# Altium project coursework_larionov.PrjPcb (part 2 of 2)

## Sheet 006_HDMI.SchDoc: Плата материнская Jetson Nano
size 840 x 594 mm; ApprovedBy: Капустин; CheckedBy: Капустин; DrawnBy: Ларионов; DocumentNumber: СПБПУ.3331506.016Ý3; SheetNumber: 6; SheetTotal: 9; DocumentCode: Ý3; ImagePath: СПБПУ.3331506.016
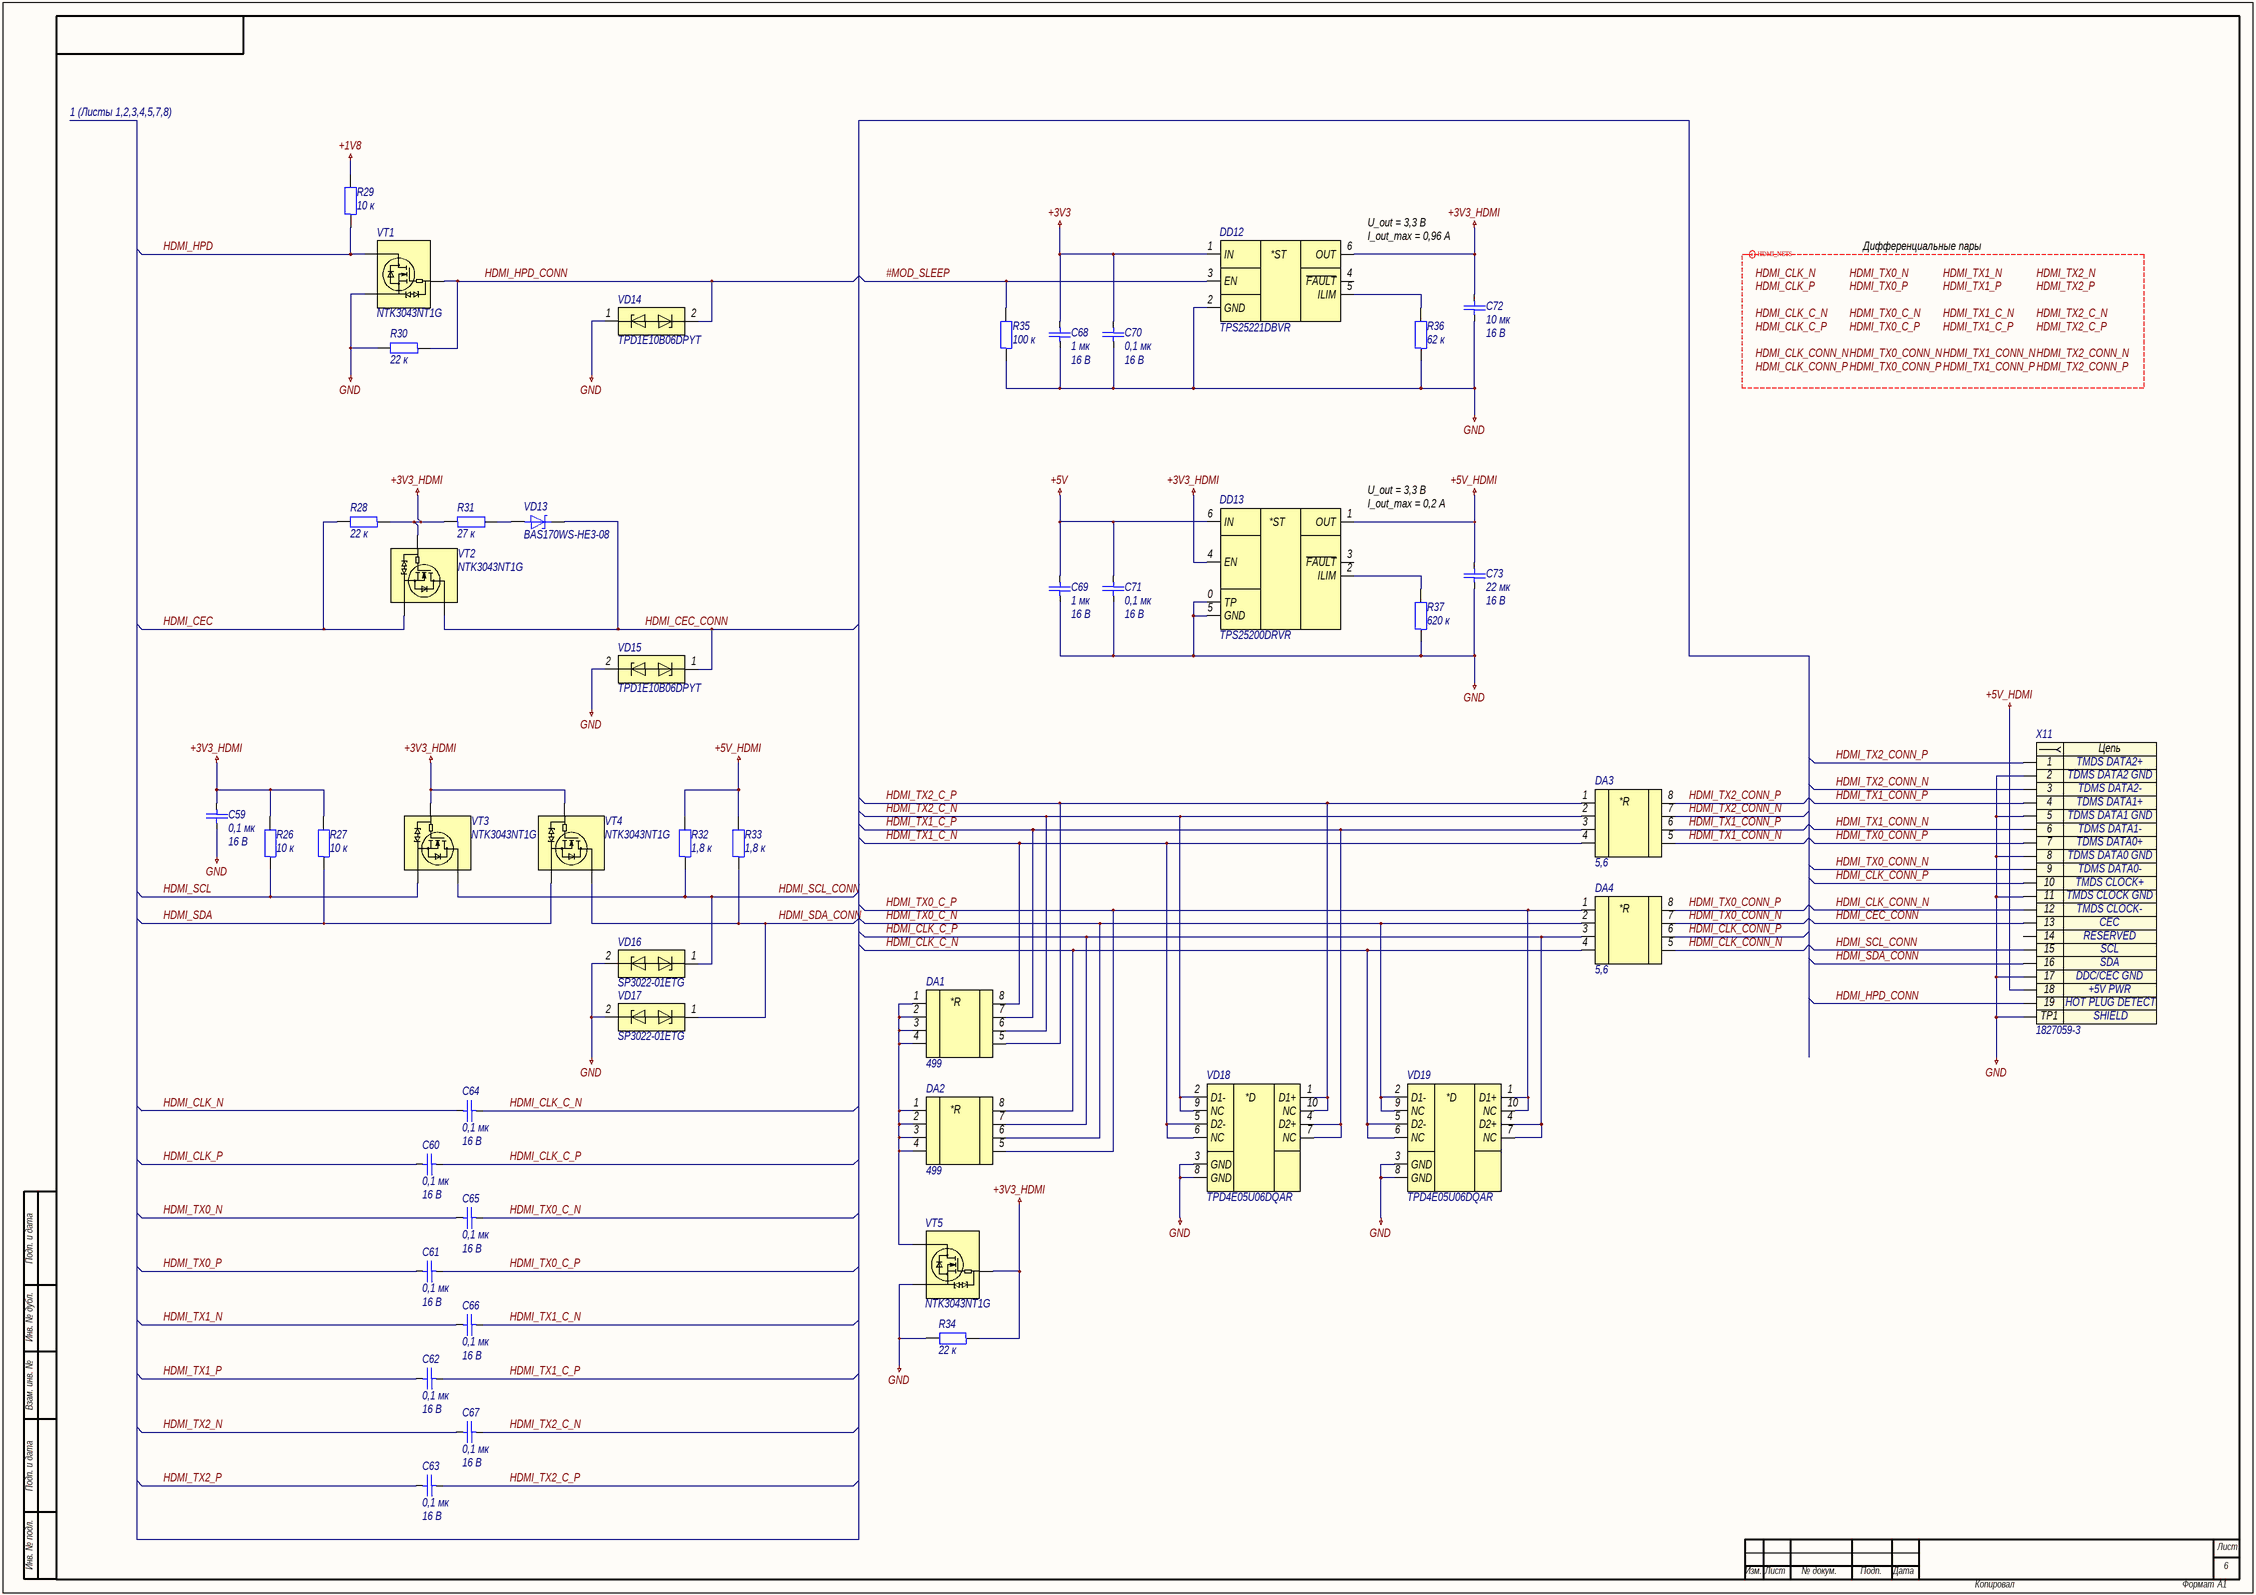
[diagram p5: 006_HDMI.SchDoc]

### Parts
C59  0,1 мк  Напряжение: 16 В  [C0603]
C60  0,1 мк  Напряжение: 16 В  [C0603]
C61  0,1 мк  Напряжение: 16 В  [C0603]
C62  0,1 мк  Напряжение: 16 В  [C0603]
C63  0,1 мк  Напряжение: 16 В  [C0603]
C64  0,1 мк  Напряжение: 16 В  [C0603]
C65  0,1 мк  Напряжение: 16 В  [C0603]
C66  0,1 мк  Напряжение: 16 В  [C0603]
C67  0,1 мк  Напряжение: 16 В  [C0603]
C68  1 мк  Напряжение: 16 В  [C0603]
C69  1 мк  Напряжение: 16 В  [C0603]
C70  0,1 мк  Напряжение: 16 В  [C0603]
C71  0,1 мк  Напряжение: 16 В  [C0603]
C72  10 мк  Напряжение: 16 В  [C0603]
C73  22 мк  Напряжение: 16 В  [C0805]
DA1  499  [R0603-X4]
DA2  499  [R0603-X4]
DA3  5,6  [R0603-X4]
DA4  5,6  [R0603-X4]
DD12  TPS25221DBVR  [SOT-23-6-P95-290X280X145]
DD13  TPS25200DRVR  [WSON-6-P65-200X200X80-L30X25-T170X110]
R26  10 к  [R0603]
R27  10 к  [R0603]
R28  22 к  [R0603]
R29  10 к  [R0603]
R30  22 к  [R0603]
R31  27 к  [R0603]
R32  1,8 к  [R0603]
R33  1,8 к  [R0603]
R34  22 к  [R0603]
R35  100 к  [R0603]
R36  62 к  [R0603]
R37  620 к  [R0603]
VD13  BAS170WS-HE3-08  [SOD-123-268X130X115]
VD14  TPD1E10B06DPYT  [X1SON-2-100X60X45]
VD15  TPD1E10B06DPYT  [X1SON-2-100X60X45]
VD16  SP3022-01ETG  [SOD-882-100X60X60]
VD17  SP3022-01ETG  [SOD-882-100X60X60]
VD18  TPD4E05U06DQAR  [USON-10-P50-250X100X55-L36X20]
VD19  TPD4E05U06DQAR  [USON-10-P50-250X100X55-L36X20]
VT1  NTK3043NT1G  [SOT-723-3-P40-120X120X55]
VT2  NTK3043NT1G  [SOT-723-3-P40-120X120X55]
VT3  NTK3043NT1G  [SOT-723-3-P40-120X120X55]
VT4  NTK3043NT1G  [SOT-723-3-P40-120X120X55]
VT5  NTK3043NT1G  [SOT-723-3-P40-120X120X55]
X11  1827059-3  [1827059-3]

### Nets
+1V8: R29.2
+3V3: C68.1 C70.2 DD12.1(IN)
+3V3_HDMI: C59.2 C72.1 DD12.6(OUT) DD13.4(EN) R26.2 R27.2 R28.1 R31.1 R34.1 VT2.G VT3.G VT4.G VT5.G
+5V: C69.1 C71.2 DD13.6(IN)
+5V_HDMI: C73.1 DD13.1(OUT) R32.2 R33.2 X11.18
GND: C59.1 C68.2 C69.2 C70.1 C71.1 C72.2 C73.2 DD12.2(GND) DD13.0(TP) DD13.5(GND) R30.2 R34.2 R35.1 R36.1 R37.1 VD14.1 VD15.2 VD16.2 VD17.2 VD18.3(GND) VD18.8(GND) VD19.3(GND) VD19.8(GND) VT1.S VT5.S X11.2 X11.5 X11.8 X11.11 X11.17 X11.TP1
#MOD_SLEEP: DD12.3(EN) R35.2
HDMI_CEC: R28.2 VT2.S
HDMI_CEC_CONN: VD13.1 VD15.1 VT2.D X11.13
HDMI_CLK_C_N: C64.2 DA2.8 DA4.4 VD19.5(D2-) VD19.6(NC)
HDMI_CLK_C_P: C60.2 DA2.7 DA4.3 VD19.4(D2+) VD19.7(NC)
HDMI_CLK_CONN_N: DA4.5 X11.12
HDMI_CLK_CONN_P: DA4.6 X11.10
HDMI_CLK_N: C64.1
HDMI_CLK_P: C60.1
HDMI_HPD: R29.1 VT1.D
HDMI_HPD_CONN: R30.1 VD14.2 VT1.G X11.19
HDMI_SCL: R26.1 VT3.S
HDMI_SCL_CONN: R32.1 VD16.1 VT3.D X11.15
HDMI_SDA: R27.1 VT4.S
HDMI_SDA_CONN: R33.1 VD17.1 VT4.D X11.16
HDMI_TX0_C_N: C65.2 DA2.6 DA4.2 VD19.2(D1-) VD19.9(NC)
HDMI_TX0_C_P: C61.2 DA2.5 DA4.1 VD19.1(D1+) VD19.10(NC)
HDMI_TX0_CONN_N: DA4.7 X11.9
HDMI_TX0_CONN_P: DA4.8 X11.7
HDMI_TX0_N: C65.1
HDMI_TX0_P: C61.1
HDMI_TX1_C_N: C66.2 DA1.8 DA3.4 VD18.5(D2-) VD18.6(NC)
HDMI_TX1_C_P: C62.2 DA1.7 DA3.3 VD18.4(D2+) VD18.7(NC)
HDMI_TX1_CONN_N: DA3.5 X11.6
HDMI_TX1_CONN_P: DA3.6 X11.4
HDMI_TX1_N: C66.1
HDMI_TX1_P: C62.1
HDMI_TX2_C_N: C67.2 DA1.6 DA3.2 VD18.2(D1-) VD18.9(NC)
HDMI_TX2_C_P: C63.2 DA1.5 DA3.1 VD18.1(D1+) VD18.10(NC)
HDMI_TX2_CONN_N: DA3.7 X11.3
HDMI_TX2_CONN_P: DA3.8 X11.1
HDMI_TX2_N: C67.1
HDMI_TX2_P: C63.1
NetDA1_1: DA1.1 DA1.2 DA1.3 DA1.4 DA2.1 DA2.2 DA2.3 DA2.4 VT5.D
NetDD12_5: DD12.5(ILIM) R36.2
NetDD13_2: DD13.2(ILIM) R37.2
NetR31_2: R31.2 VD13.2

Not connected (* = marked no-connect by the designer): DD12 4(~{FAULT}); DD13 3(~{FAULT}); X11 14

### Layout directives
differential pair; rule Differential Pairs Routing [Pref Gap = 0.3mm    Min Gap  = 0.15mm    Max Gap  = 0.3mmPref Width = 0.126mm    Min Width  = 0.126mm    Max Width  = 0.155mm]; differential pair class HDMI_SIGNALS: HDMI_CLK_C_N, HDMI_CLK_C_P, HDMI_CLK_CONN_N, HDMI_CLK_CONN_P, HDMI_CLK_N, HDMI_CLK_P, HDMI_TX0_C_N, HDMI_TX0_C_P, HDMI_TX0_CONN_N, HDMI_TX0_CONN_P, HDMI_TX0_N, HDMI_TX0_P, HDMI_TX1_C_N, HDMI_TX1_C_P, HDMI_TX1_CONN_N, HDMI_TX1_CONN_P, HDMI_TX1_N, HDMI_TX1_P, HDMI_TX2_C_N, HDMI_TX2_C_P, HDMI_TX2_CONN_N, HDMI_TX2_CONN_P, HDMI_TX2_N, HDMI_TX2_P

### Notes on the sheet
- 1 (Листы 1,2,3,4,5,7,8)
- U_out = 3,3 В
  I_out_max = 0,96 А
- Дифференциальные пары
- U_out = 3,3 В
  I_out_max = 0,2 А
- Labels drawn without touching a wire or pin: HDMI_CLK_C_N, HDMI_CLK_C_P, HDMI_CLK_CONN_N, HDMI_CLK_CONN_P, HDMI_CLK_N, HDMI_CLK_P, HDMI_TX0_C_N, HDMI_TX0_C_P, HDMI_TX0_CONN_N, HDMI_TX0_CONN_P, HDMI_TX0_N, HDMI_TX0_P, HDMI_TX1_C_N, HDMI_TX1_C_P, HDMI_TX1_CONN_N, HDMI_TX1_CONN_P, HDMI_TX1_N, HDMI_TX1_P, HDMI_TX2_C_N, HDMI_TX2_C_P, HDMI_TX2_CONN_N, HDMI_TX2_CONN_P, HDMI_TX2_N, HDMI_TX2_P
- Подп. и дата
- Инв. № дубл.
- Взам. инв. №
- Инв. № подл.
- Лист
- Изм.
- № докум.
- Подп.
- Дата
- Копировал
- Формат
- А1
- (in symbol da0004) *R
- (in symbol da0026) *R
- (in symbol dd0001) *ST
- (in symbol dd0002) *ST
- (in symbol vd0017) *D
- (in symbol x0012) Цепь

### Library data of the parts
C59-C67 C70 C71 = c0081: as C9 on sheet 001_Jetson_Nano; Номинал: 0,1 мк; Номинальное напряжение: 16 В; HelpURL: https://www.yageo.com/upload/media/product/productsearch/datasheet/mlcc/UPY-GPHC_X7R_6.3V-to-50V_20.pdf
C68 C69 = c0113: =Описание; ID: c0113; Фамилия: Паньков; Описание: Конденсатор керамический чип 0603 1 мкФ 16 В ±10 %; Наименование: CC0603KRX7R7BB105; Производитель: YAGEO Corp.; Отклонение: ±10 %; Рабочие температуры: от –55 °С до +125 °С; Температурный коэффициент емкости: X7R; Корпус: 0603; Номинал: 1 мк; Номинальное напряжение: 16 В; HelpURL: https://www.yageo.com/upload/media/product/productsearch/datasheet/mlcc/UPY-GPHC_X7R_6.3V-to-50V_20.pdf
C72 = c0145: =Описание; ID: c0145; Фамилия: Паньков; Описание: Конденсатор керамический чип 0603 10 мкФ 16 В ±10 %; Наименование: CC0603KRX5R7BB106; Производитель: YAGEO Corp.; Отклонение: ±10 %; Рабочие температуры: от –55 °С до +85 °С; Температурный коэффициент емкости: X5R; Корпус: 0603; Номинал: 10 мк; Номинальное напряжение: 16 В; HelpURL: https://www.yageo.com/upload/media/product/productsearch/datasheet/mlcc/UPY-GPHC_X5R_4V-to-50V_26.pdf
C73 = c0159: =Описание; ID: c0159; Фамилия: Паньков; Описание: Конденсатор керамический чип 0805 22 мкФ 16 В ±20 %; Наименование: CC0805MRX5R7BB226; Производитель: YAGEO Corp.; Отклонение: ±20 %; Рабочие температуры: от –55 °С до +85 °С; Температурный коэффициент емкости: X5R; Корпус: 0805; Номинал: 22 мк; Номинальное напряжение: 16 В; HelpURL: https://www.yageo.com/upload/media/product/productsearch/datasheet/mlcc/UPY-GPHC_X5R_4V-to-50V_26.pdf
DA1 DA2 = da0026: =Описание; ID: da0026; Фамилия: Ларионов; Описание: Резисторная сборка чип 0603 x4 499 Ом ±1 % 0,1 Вт; Наименование: TC164-FR-07499RL; Производитель: YAGEO Corp.; Отклонение: ±1 %; Номинальное напряжение: 50 В; Номинальный ток: 1 А; Рабочие температуры: от –55 °С до +155 °С; Корпус: 0603 x4; Номинал: 499; HelpURL: https://www.yageo.com/upload/media/product/productsearch/datasheet/rchip/PYu-YC_TC_group_51_RoHS_L_9.pdf
DA3 DA4 = da0004: =Описание; ID: da0004; Фамилия: Ларионов; Описание: Резисторная сборка чип 0603 x4 5,6 Ом ±5 % 0,1 Вт; Наименование: TC164-JR-075R6L; Производитель: YAGEO Corp.; Отклонение: ±5 %; Номинальное напряжение: 50 В; Номинальный ток: 1 А; Рабочие температуры: от –55 °С до +155 °С; Корпус: 0603 x4; Номинал: 5,6; HelpURL: https://www.yageo.com/upload/media/product/productsearch/datasheet/rchip/PYu-YC_TC_group_51_RoHS_L_9.pdf
DD12 = dd0001: =Описание; ID: dd0001; Фамилия: Ларионов; Описание: Силовой ключ 5,5 В и 2,5 А; Производитель: Texas Instruments Inc.; Напряжение: от 2,5 В до 5,5 В; Максимальное напряжение: 5,5 В; Ток: от 0,25 А до 2,7 А; Рабочие температуры: от –40 °С до +125 °С; Корпус: SOT-23-6; Наименование: TPS25221DBVR; HelpURL: https://www.ti.com/product/TPS25221
DD13 = dd0002: =Описание; ID: dd0002; Фамилия: Ларионов; Описание: Защитная микросхема eFuse 6,5 В и 2,9 А; Производитель: Texas Instruments Inc.; Напряжение: от 2,5 В до 6,5 В; Максимальное напряжение: 20 В; Ток: от 0,085 А до 2,9 А; Рабочие температуры: от –40 °С до +125 °С; Корпус: WSON-6; Наименование: TPS25200DRVR; HelpURL: https://www.ti.com/product/TPS25200
R26 R27 R29 = r0105: =Описание; ID: r0105; Фамилия: Самарин; Описание: Резистор чип 0603 10 кОм ±1 % 0,1 Вт; Наименование: RC0603FR-0710KL; Производитель: YAGEO Corp.; Отклонение: ±1 %; Номинальное напряжение: 75 В; Номинальный ток: 1 А; Рабочие температуры: от –55 °С до +155 °С; Корпус: 0603; Примечание: Ряд E24; Номинал: 10 к; HelpURL: https://www.yageo.com/upload/media/product/productsearch/datasheet/rchip/PYu-RC_Group_51_RoHS_L_11.pdf
R28 R30 R34 = r0117: =Описание; ID: r0117; Фамилия: Паньков; Описание: Резистор чип 0603 22 кОм ±1 % 0,1 Вт; Наименование: RC0603FR-0722KL; Производитель: YAGEO Corp.; Отклонение: ±1 %; Номинальное напряжение: 75 В; Номинальный ток: 1 А; Рабочие температуры: от –55 °С до +155 °С; Корпус: 0603; Примечание: Ряд E24; Номинал: 22 к; HelpURL: https://www.yageo.com/upload/media/product/productsearch/datasheet/rchip/PYu-RC_Group_51_RoHS_L_11.pdf
R31 = r0120: =Описание; ID: r0120; Фамилия: Паньков; Описание: Резистор чип 0603 27 кОм ±1 % 0,1 Вт; Наименование: RC0603FR-0727KL; Производитель: YAGEO Corp.; Отклонение: ±1 %; Номинальное напряжение: 75 В; Номинальный ток: 1 А; Рабочие температуры: от –55 °С до +155 °С; Корпус: 0603; Примечание: Ряд E24; Номинал: 27 к; HelpURL: https://www.yageo.com/upload/media/product/productsearch/datasheet/rchip/PYu-RC_Group_51_RoHS_L_11.pdf
R32 R33 = r0083: =Описание; ID: r0083; Фамилия: Паньков; Описание: Резистор чип 0603 1,8 кОм ±1 % 0,1 Вт; Наименование: RC0603FR-071K8L; Производитель: YAGEO Corp.; Отклонение: ±1 %; Номинальное напряжение: 75 В; Номинальный ток: 1 А; Рабочие температуры: от –55 °С до +155 °С; Корпус: 0603; Примечание: Ряд E24; Номинал: 1,8 к; HelpURL: https://www.yageo.com/upload/media/product/productsearch/datasheet/rchip/PYu-RC_Group_51_RoHS_L_11.pdf
R35 = r0141: as R1 on sheet 001_Jetson_Nano; Номинал: 100 к; HelpURL: https://www.yageo.com/upload/media/product/productsearch/datasheet/rchip/PYu-RC_Group_51_RoHS_L_11.pdf
R36 = r0135: =Описание; ID: r0135; Фамилия: Паньков; Описание: Резистор чип 0603 62 кОм ±1 % 0,1 Вт; Наименование: RC0603FR-0762KL; Производитель: YAGEO Corp.; Отклонение: ±1 %; Номинальное напряжение: 75 В; Номинальный ток: 1 А; Рабочие температуры: от –55 °С до +155 °С; Корпус: 0603; Примечание: Ряд E24; Номинал: 62 к; HelpURL: https://www.yageo.com/upload/media/product/productsearch/datasheet/rchip/PYu-RC_Group_51_RoHS_L_11.pdf
R37 = r0168: =Описание; ID: r0168; Фамилия: Паньков; Описание: Резистор чип 0603 620 кОм ±1 % 0,1 Вт; Наименование: RC0603FR-07620KL; Производитель: YAGEO Corp.; Отклонение: ±1 %; Номинальное напряжение: 75 В; Номинальный ток: 1 А; Рабочие температуры: от –55 °С до +155 °С; Корпус: 0603; Примечание: Ряд E24; Номинал: 620 к; HelpURL: https://www.yageo.com/upload/media/product/productsearch/datasheet/rchip/PYu-RC_Group_51_RoHS_L_11.pdf
VD13 = vd0006: =Описание; ID: vd0006; Фамилия: Ларионов; Описание: Диод Шоттки 70 В 0,07 А; Производитель: Vishay Intertechnology, Inc.; Максимальное прямое напряжение: 0,75 В; Максимальное обратное напряжение: 70 В; Максимальный прямой ток: 0,07 А; Рабочие температуры: от –55 °С до +125 °С; Корпус: SOD-123; Наименование: BAS170WS-HE3-08; HelpURL: https://www.vishay.com/diodes/list/product-85653/
VD14 VD15 = vd0013: =Описание; ID: vd0013; Фамилия: Ларионов; Описание: Двунаправленная диодная сборка для подавления помех 5,5 В; Производитель: Texas Instruments Inc.; Корпус: X1SON-2; Наименование: TPD1E10B06DPYT; HelpURL: https://www.ti.com/product/TPD1E10B06
VD16 VD17 = vd0003: =Описание; ID: vd0003; Фамилия: Ларионов; Описание: Двунаправленная диодная сборка для подавления помех 5 В; Производитель: Littelfuse, Inc.; Корпус: SOD-882; Наименование: SP3022-01ETG; HelpURL: https://www.littelfuse.com/products/tvs-diode-arrays/low-capacitance-esd-protection/sp3022.aspx#
VD18 VD19 = vd0017: =Описание; ID: vd0017; Фамилия: Ларионов; Описание: Диодная сборка для подавления помех 5,5 В; Производитель: Texas Instruments Inc.; Корпус: USON-10; Наименование: TPD4E05U06DQAR; HelpURL: https://www.ti.com/product/TPD4E05U06
VT1-VT5 = vt0001: =Описание; ID: vt0001; Фамилия: Ларионов; Описание: Полевой N-канальный МДП-транзистор 20 В 0,255 А; Производитель: ON Semiconductor; Напряжение затвор — исток: ±10 В; Напряжение сток — исток: 20 В; Ток стока: 0,255 А; Сопротивление сток — исток: 15 Ом; Рабочие температуры: от –55 °С до +150 °С; Корпус: SOT-723; Наименование: NTK3043NT1G; HelpURL: https://www.onsemi.com/products/discretes-drivers/mosfets/ntk3043n
X11 = x0012: =Описание; Contact_1: TMDS DATA2+; Contact_2: TDMS DATA2 GND; Contact_3: TDMS DATA2-; Contact_4: TDMS DATA1+; Contact_5: TDMS DATA1 GND; Contact_6: TDMS DATA1-; Contact_7: TDMS DATA0+; Contact_8: TDMS DATA0 GND; Contact_9: TDMS DATA0-; Contact_10: TMDS CLOCK+; Contact_11: TMDS CLOCK GND; Contact_12: TMDS CLOCK-; Contact_13: CEC; Contact_14: RESERVED; Contact_15: SCL; Contact_16: SDA; Contact_17: DDC/CEC GND; Contact_18: +5V PWR; Contact_19: HOT PLUG DETECT; TP1: SHIELD; ID: x0012; Фамилия: Паньков; Описание: HDMI Type A гнездо угловой; Производитель: TE Connectivity; Наименование: 1827059-3; HelpURL: https://www.te.com/usa-en/product-1827059-3.html

## Sheet 007_Ethernet.SchDoc: Плата материнская Jetson Nano
size 420 x 297 mm; ApprovedBy: Капустин; CheckedBy: Капустин; DrawnBy: Ларионов; DocumentNumber: СПБПУ.3331506.016Ý3; SheetNumber: 7; SheetTotal: 9; DocumentCode: Ý3; ImagePath: СПБПУ.3331506.016
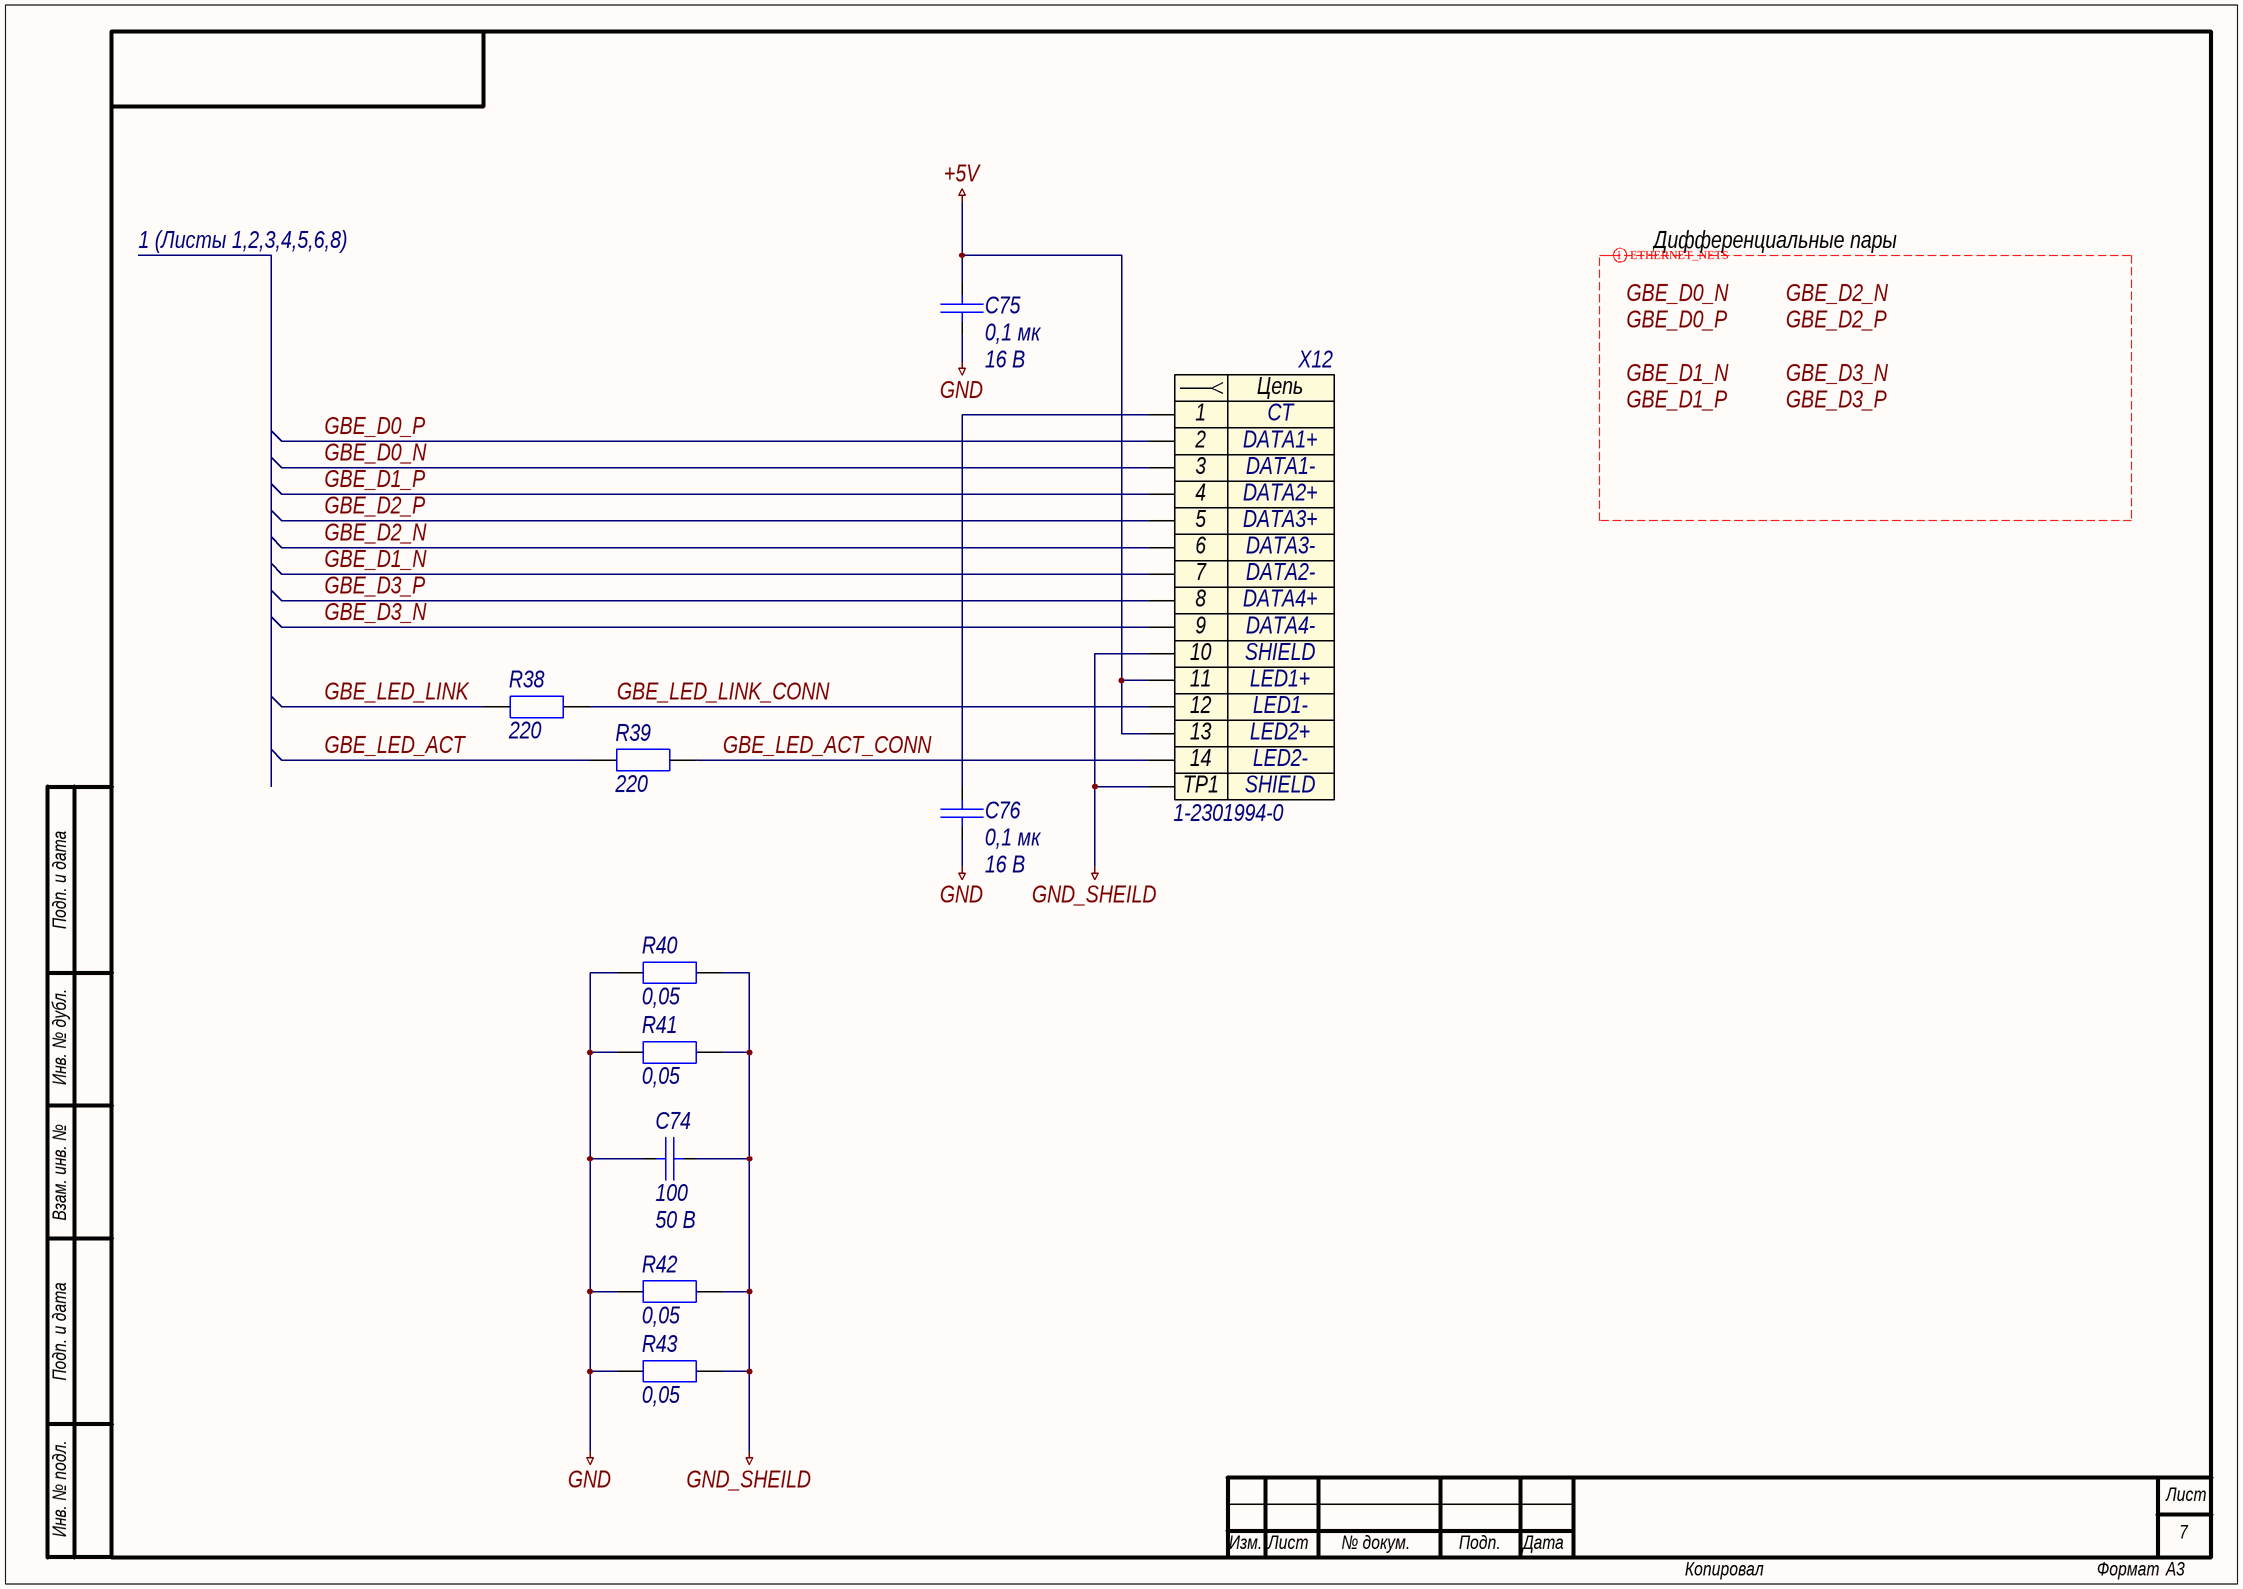
[diagram p6: 007_Ethernet.SchDoc]

### Parts
C74  100  Напряжение: 50 В  [C0402]
C75  0,1 мк  Напряжение: 16 В  [C0603]
C76  0,1 мк  Напряжение: 16 В  [C0603]
R38  220  [R0603]
R39  220  [R0603]
R40  0,05  [R0603]
R41  0,05  [R0603]
R42  0,05  [R0603]
R43  0,05  [R0603]
X12  1-2301994-0  [1-2301994-0]

### Nets
+5V: C75.1 X12.11 X12.13
GND: C74.2 C75.2 C76.2 R40.1 R41.1 R42.1 R43.1
GND_SHEILD: C74.1 R40.2 R41.2 R42.2 R43.2 X12.10 X12.TP1
GBE_D0_N: X12.3
GBE_D0_P: X12.2
GBE_D1_N: X12.7
GBE_D1_P: X12.4
GBE_D2_N: X12.6
GBE_D2_P: X12.5
GBE_D3_N: X12.9
GBE_D3_P: X12.8
GBE_LED_ACT: R39.1
GBE_LED_ACT_CONN: R39.2 X12.14
GBE_LED_LINK: R38.1
GBE_LED_LINK_CONN: R38.2 X12.12
NetC76_1: C76.1 X12.1

### Layout directives
differential pair; rule Differential Pairs Routing [Pref Gap = 0.3mm    Min Gap  = 0.15mm    Max Gap  = 0.3mmPref Width = 0.126mm    Min Width  = 0.126mm    Max Width  = 0.155mm]; differential pair class ETHERNET_SIGNALS: GBE_D0_N, GBE_D0_P, GBE_D1_N, GBE_D1_P, GBE_D2_N, GBE_D2_P, GBE_D3_N, GBE_D3_P

### Notes on the sheet
- 1 (Листы 1,2,3,4,5,6,8)
- Дифференциальные пары
- Labels drawn without touching a wire or pin: GBE_D0_N, GBE_D0_P, GBE_D1_N, GBE_D1_P, GBE_D2_N, GBE_D2_P, GBE_D3_N, GBE_D3_P
- Подп. и дата
- Инв. № дубл.
- Взам. инв. №
- Инв. № подл.
- Лист
- Изм.
- № докум.
- Подп.
- Дата
- Копировал
- Формат
- А3
- (in symbol x0016) Цепь

### Library data of the parts
C74 = c0004: =Описание; ID: c0004; Фамилия: Ларионов; Описание: Конденсатор керамический чип 0402 100 пФ 50 В ±1 %; Наименование: CL05C101FB5NNNC; Производитель: Samsung Electro-Mechanics; Отклонение: ±1 %; Рабочие температуры: от –55 °С до +125 °С; Температурный коэффициент емкости: C0G; Корпус: 0402; Номинал: 100; Номинальное напряжение: 50 В; HelpURL: http://product.samsungsem.com/mlcc/CL05C101FB5NNN.do
C75 C76 = c0081: =Описание; ID: c0081; Фамилия: Паньков; Описание: Конденсатор керамический чип 0603 100 нФ 16 В ±10 %; Наименование: CC0603KRX7R7BB104; Производитель: YAGEO Corp.; Отклонение: ±10 %; Рабочие температуры: от –55 °С до +125 °С; Температурный коэффициент емкости: X7R; Корпус: 0603; Номинал: 0,1 мк; Номинальное напряжение: 16 В; HelpURL: https://www.yageo.com/upload/media/product/productsearch/datasheet/mlcc/UPY-GPHC_X7R_6.3V-to-50V_20.pdf
R38 R39 = r0060: =Описание; ID: r0060; Фамилия: Ларионов; Описание: Резистор чип 0603 220 Ом ±1 % 0,1 Вт; Наименование: RC0603FR-07220RL; Производитель: YAGEO Corp.; Отклонение: ±1 %; Номинальное напряжение: 75 В; Номинальный ток: 1 А; Рабочие температуры: от –55 °С до +155 °С; Корпус: 0603; Примечание: Ряд E24; Номинал: 220; HelpURL: https://www.yageo.com/upload/media/product/productsearch/datasheet/rchip/PYu-RC_Group_51_RoHS_L_11.pdf
R40-R43 = r0002: =Описание; ID: r0002; Фамилия: Ларионов; Описание: Резистор чип 0603 50 мОм ±1 % 0,1 Вт; Наименование: RL0603FR-070R05L; Производитель: YAGEO Corp.; Отклонение: ±1 %; Номинальное напряжение: не указано; Номинальный ток: 2 А; Рабочие температуры: от –55 °С до +155 °С; Корпус: 0603; Номинал: 0,05; HelpURL: https://www.yageo.com/upload/media/product/productsearch/datasheet/rchip/PYu-RL_Group_521_RoHS_L_2.pdf
X12 = x0016: =Описание; Contact_1: CT; Contact_2: DATA1+; Contact_3: DATA1-; Contact_4: DATA2+; Contact_5: DATA3+; Contact_6: DATA3-; Contact_7: DATA2-; Contact_8: DATA4+; Contact_9: DATA4-; Contact_10: SHIELD; Contact_11: LED1+; Contact_12: LED1-; Contact_13: LED2+; Contact_14: LED2-; ID: x0016; Фамилия: Ларионов; Описание: RJ45 интегрированный трансформатор 1 Gbps LED гнездо угловой; Производитель: TE Connectivity; TP1: SHIELD; Наименование: 1-2301994-0; HelpURL: https://www.te.com/usa-en/product-1-2301994-0.html?source=header-match

## Sheet 008_Fan_GPIO_LED.SchDoc: Плата материнская Jetson Nano
size 594 x 420 mm; ApprovedBy: Капустин; CheckedBy: Капустин; DrawnBy: Ларионов; DocumentNumber: СПБПУ.3331506.016Ý3; SheetNumber: 8; SheetTotal: 9; DocumentCode: Ý3; ImagePath: СПБПУ.3331506.016
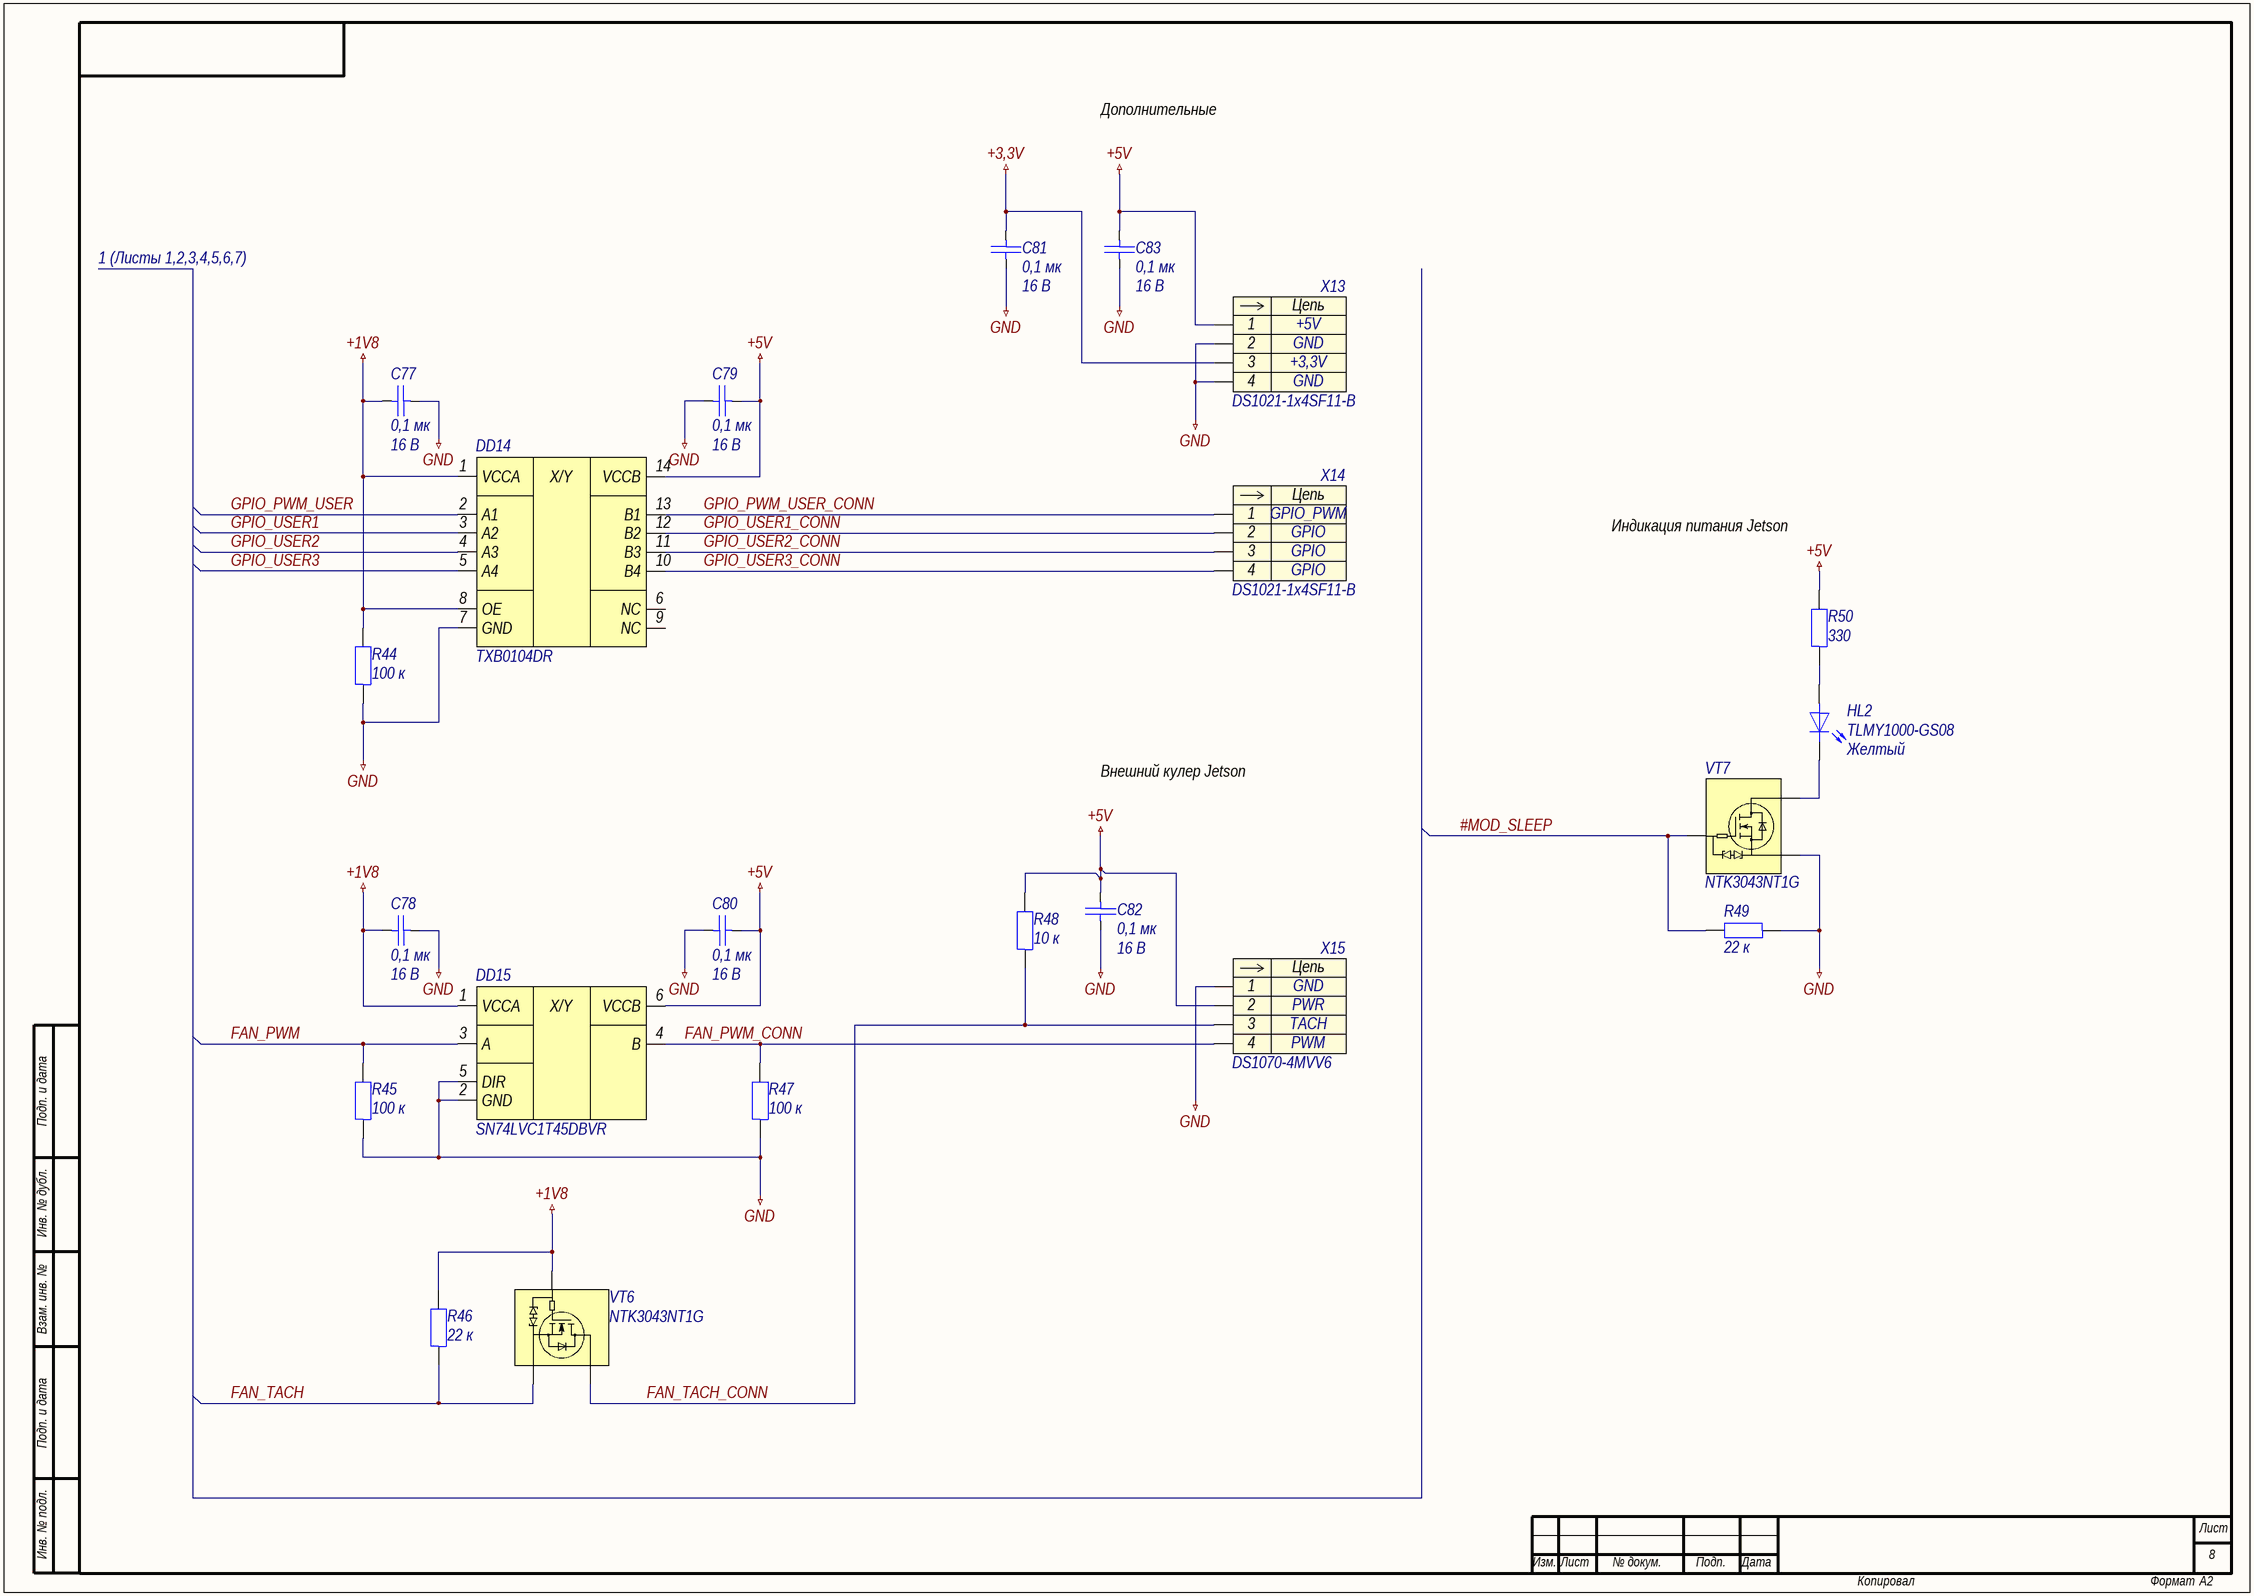
[diagram p7: 008_Fan_GPIO_LED.SchDoc]

### Parts
C77  0,1 мк  Напряжение: 16 В  [C0603]
C78  0,1 мк  Напряжение: 16 В  [C0603]
C79  0,1 мк  Напряжение: 16 В  [C0603]
C80  0,1 мк  Напряжение: 16 В  [C0603]
C81  0,1 мк  Напряжение: 16 В  [C0603]
C82  0,1 мк  Напряжение: 16 В  [C0603]
C83  0,1 мк  Напряжение: 16 В  [C0603]
DD14  TXB0104DR  [SOIC-14-P127-865X390X175-L84X41]
DD15  SN74LVC1T45DBVR  [SOT-23-6-P95-290X280X145]
HL2  TLMY1000-GS08  Цвет: Желтый  [HL0603]
R44  100 к  [R0603]
R45  100 к  [R0603]
R46  22 к  [R0603]
R47  100 к  [R0603]
R48  10 к  [R0603]
R49  22 к  [R0603]
R50  330  [R0603]
VT6  NTK3043NT1G  [SOT-723-3-P40-120X120X55]
VT7  NTK3043NT1G  [SOT-723-3-P40-120X120X55]
X13  DS1021-1x4SF11-B  [DS1021-1X4SF11-B]
X14  DS1021-1x4SF11-B  [DS1021-1X4SF11-B]
X15  DS1070-4MVV6  [DS1070-4MVV6]

### Nets
+1V8: C77.1 C78.1 DD14.1(VCCA) DD14.8(OE) DD15.1(VCCA) R44.2 R46.2 VT6.G
+3,3V: C81.2 X13.3
+5V: C79.2 C80.1 C82.2 C83.2 DD14.14(VCCB) DD15.6(VCCB) R48.2 R50.2 X13.1 X15.2
GND: C77.2 C78.2 C79.1 C80.2 C81.1 C82.1 C83.1 DD14.7(GND) DD15.2(GND) DD15.5(DIR) R44.1 R45.1 R47.1 R49.1 VT7.S X13.2 X13.4 X15.1
#MOD_SLEEP: R49.2 VT7.G
FAN_PWM: DD15.3(A) R45.2
FAN_PWM_CONN: DD15.4(B) R47.2 X15.4
FAN_TACH: R46.1 VT6.S
FAN_TACH_CONN: R48.1 VT6.D X15.3
GPIO_PWM_USER: DD14.2(A1)
GPIO_PWM_USER_CONN: DD14.13(B1) X14.1
GPIO_USER1: DD14.3(A2)
GPIO_USER1_CONN: DD14.12(B2) X14.2
GPIO_USER2: DD14.4(A3)
GPIO_USER2_CONN: DD14.11(B3) X14.3
GPIO_USER3: DD14.5(A4)
GPIO_USER3_CONN: DD14.10(B4) X14.4
NetHL2_1: HL2.1 VT7.D
NetHL2_2: HL2.2 R50.1

Not connected (* = marked no-connect by the designer): DD14 6(NC) 9(NC)

### Notes on the sheet
- Дополнительные функции
- 1 (Листы 1,2,3,4,5,6,7)
- Индикация питания Jetson Nano
- Внешний кулер Jetson Nano
- Подп. и дата
- Инв. № дубл.
- Взам. инв. №
- Инв. № подл.
- Лист
- Изм.
- № докум.
- Подп.
- Дата
- Копировал
- Формат
- А2
- (in symbol dd0001) X/Y
- (in symbol dd0002) X/Y
- (in symbol x0027) Цепь
- (in symbol x0048) Цепь

### Library data of the parts
C77-C83 = c0081: as C75 on sheet 007_Ethernet; Номинал: 0,1 мк; Номинальное напряжение: 16 В; HelpURL: https://www.yageo.com/upload/media/product/productsearch/datasheet/mlcc/UPY-GPHC_X7R_6.3V-to-50V_20.pdf
DD14 = dd0002: =Описание; ID: dd0002; Фамилия: Ларионов; Описание: Преобразователь логического уровня 3,6 В и 5,5 В 4 линии; Производитель: Texas Instruments Inc.; Входное напряжение: от 1,2 В до 3,6 В; Выходное напряжение: от 1,65 В до 5,5 В; Рабочие температуры: от –40 °С до +85 °С; Корпус: SOIC-14; Наименование: TXB0104DR; HelpURL: https://www.ti.com/product/TXB0104
DD15 = dd0001: =Описание; ID: dd0001; Фамилия: Ларионов; Описание: Преобразователь логического уровня 5,5 В и 5,5 В 1 линия; Производитель: Texas Instruments Inc.; Входное напряжение: от 1,08 В до 5,5 В; Выходное напряжение: от 1,65 В до 5,5 В; Рабочие температуры: от –40 °С до +85 °С; Корпус: SOT-23-6; Наименование: SN74LVC1T45DBVR; HelpURL: https://www.ti.com/product/SN74LVC1T45
HL2 = hl0003: =Описание; ID: hl0003; Фамилия: Ларионов; Описание: Светодиод чип 0603 желтый; Производитель: Vishay Intertechnology, Inc.; Номинальная сила света: 7,5 мкд; Номинальная длина волны: 588 нм; Номинальный прямой ток: 15 мА; Номинальное падение напряжения: 1,8 В; Рассеиваемая мощность: 40 мВт; Рабочие температуры: от –40 °С до +100 °С; Корпус: 0603; Наименование: TLMY1000-GS08; HelpURL: https://www.vishay.com/leds/list/product-83172/
R44 R45 R47 = r0141: =Описание; ID: r0141; Фамилия: Водорезов; Описание: Резистор чип 0603 100 кОм ±1 % 0,1 Вт; Наименование: RC0603FR-07100KL; Производитель: YAGEO Corp.; Отклонение: ±1 %; Номинальное напряжение: 75 В; Номинальный ток: 1 А; Рабочие температуры: от –55 °С до +155 °С; Корпус: 0603; Примечание: Ряд E24; Номинал: 100 к; HelpURL: https://www.yageo.com/upload/media/product/productsearch/datasheet/rchip/PYu-RC_Group_51_RoHS_L_11.pdf
R46 R49 = r0117: =Описание; ID: r0117; Фамилия: Паньков; Описание: Резистор чип 0603 22 кОм ±1 % 0,1 Вт; Наименование: RC0603FR-0722KL; Производитель: YAGEO Corp.; Отклонение: ±1 %; Номинальное напряжение: 75 В; Номинальный ток: 1 А; Рабочие температуры: от –55 °С до +155 °С; Корпус: 0603; Примечание: Ряд E24; Номинал: 22 к; HelpURL: https://www.yageo.com/upload/media/product/productsearch/datasheet/rchip/PYu-RC_Group_51_RoHS_L_11.pdf
R48 = r0105: =Описание; ID: r0105; Фамилия: Самарин; Описание: Резистор чип 0603 10 кОм ±1 % 0,1 Вт; Наименование: RC0603FR-0710KL; Производитель: YAGEO Corp.; Отклонение: ±1 %; Номинальное напряжение: 75 В; Номинальный ток: 1 А; Рабочие температуры: от –55 °С до +155 °С; Корпус: 0603; Примечание: Ряд E24; Номинал: 10 к; HelpURL: https://www.yageo.com/upload/media/product/productsearch/datasheet/rchip/PYu-RC_Group_51_RoHS_L_11.pdf
R50 = r0064: =Описание; ID: r0064; Фамилия: Ларионов; Описание: Резистор чип 0603 330 Ом ±1 % 0,1 Вт; Наименование: RC0603FR-07330RL; Производитель: YAGEO Corp.; Отклонение: ±1 %; Номинальное напряжение: 75 В; Номинальный ток: 1 А; Рабочие температуры: от –55 °С до +155 °С; Корпус: 0603; Примечание: Ряд E24; Номинал: 330; HelpURL: https://www.yageo.com/upload/media/product/productsearch/datasheet/rchip/PYu-RC_Group_51_RoHS_L_11.pdf
VT6 VT7 = vt0001: =Описание; ID: vt0001; Фамилия: Ларионов; Описание: Полевой N-канальный МДП-транзистор 20 В 0,255 А; Производитель: ON Semiconductor; Напряжение затвор — исток: ±10 В; Напряжение сток — исток: 20 В; Ток стока: 0,255 А; Сопротивление сток — исток: 15 Ом; Рабочие температуры: от –55 °С до +150 °С; Корпус: SOT-723; Наименование: NTK3043NT1G; HelpURL: https://www.onsemi.com/products/discretes-drivers/mosfets/ntk3043n
X13 = x0027: =Описание; Contact_1: +5V; Contact_2: GND; Contact_3: +3,3V; ID: x0027; Фамилия: Паньков; Описание: PLS 4 pin 2,54 мм вилка прямой; Производитель: Connfly Electronic Co., Ltd.; Contact_4: GND; Наименование: DS1021-1x4SF11-B; HelpURL: http://en.connfly.group/product/xVkr=EusQssAN0gN=Aos=mU+UrVkR9kqEAN0gN9g+WqANB+A
X14 = x0027: =Описание; Contact_1: GPIO_PWM; Contact_2: GPIO; ID: x0027; Фамилия: Паньков; Описание: PLS 4 pin 2,54 мм вилка прямой; Производитель: Connfly Electronic Co., Ltd.; Contact_3: GPIO; Contact_4: GPIO; Наименование: DS1021-1x4SF11-B; HelpURL: http://en.connfly.group/product/xVkr=EusQssAN0gN=Aos=mU+UrVkR9kqEAN0gN9g+WqANB+A
X15 = x0048: =Описание; Contact_1: GND; Contact_2: PWR; Contact_3: TACH; Contact_4: PWM; ID: x0048; Фамилия: Ларионов; Описание: Power Connector 4 pin 2,54 мм вилка прямой; Производитель: Connfly Electronic Co., Ltd.; Наименование: DS1070-4MVV6; HelpURL: http://en.connfly.group/product/xVkr=EusQssAN0gN=Aos=mU+UrVkR9kqEAN0gN0MUqANB+A

## Sheet template_n_revision_sheet.SchDoc: Плата материнская Jetson Nano
size 209 x 297 mm; ApprovedBy: Капустин; CheckedBy: Капустин; DrawnBy: Ларионов; DocumentNumber: СПБПУ.3331506.016Ý3; SheetNumber: 9; SheetTotal: m; DocumentCode: Ý3; PageSetup: Record=PageOptions|CenterHorizontal=True|CenterVertical=True|PrintScale=0.67|XCorrection=1.00|YCorrection=1.00|PrintKind=1|BorderSize=5000000|LeftOffset=0|BottomOffset=0|Orientation=2|PaperLength=1000|PaperWidth=1000|Scale=100|PaperSource=258|PrintQuality=600|MediaType=1|DitherType=10|PaperKind=A4|PrintScaleMode=1; Format: A4; Создавать изделие в PLM: No; Вид изделия: Документация; Раздел: Документация; ProductView: Документация; Класс документа: Конструкторский документ; DocumentClass: Конструкторский документ; Вид документа: Схема электрическая принципиальная; DocumentView: Схема электрическая принципиальная; DocumentType: тип схемы; Код документа: Э3; ImagePath: СПБПУ.3331506.016

### Notes on the sheet
- Лист регистрации изменений
- Изм.
- изме-
- Номера листов (страниц)
- заме-
- новых
- аннули-
- (страниц)
- листов
- Всего
- документа
- Номер
- сопроводительного
- документа и дата
- Входящий номер
- Подпись
- Дата
- ненных
- рованных
- в документе
- Подп. и дата
- Инв. № дубл.
- Взам. инв. №
- Инв. № подл.
- Лист
- Номер докум.
- Подп.
- Копировал
- Формат   А4

## Nets that join several sheets
+1V8: 002_Buck_Converter (C25.1 DD6.5 R6.2), 003_Serial_Port (C31.1 DD7.1 DD7.8 R14.2), 005_DP (C55.2 DD10.5), 006_HDMI (R29.2), 008_Fan_GPIO_LED (8 pins)
+3V3: 002_Buck_Converter (9 pins), 005_DP (C56.1 C57.2 DD11.6), 006_HDMI (C68.1 C70.2 DD12.1)
+5V: 001_Jetson_Nano (27 pins), 002_Buck_Converter (24 pins), 003_Serial_Port (6 pins), 004_USB (11 pins), 006_HDMI (C69.1 C71.2 DD13.6), 007_Ethernet (C75.1 X12.11 X12.13), 008_Fan_GPIO_LED (10 pins)
GND: 001_Jetson_Nano (84 pins), 002_Buck_Converter (38 pins), 003_Serial_Port (12 pins), 004_USB (25 pins), 005_DP (26 pins), 006_HDMI (31 pins), 007_Ethernet (7 pins), 008_Fan_GPIO_LED (18 pins)
3V3_PWR_GOOD: 002_Buck_Converter (DD5.4 DD6.3 R8.2), 005_DP (DD11.4)
#MOD_SLEEP: 001_Jetson_Nano (X1.178), 006_HDMI (DD12.3 R35.2), 008_Fan_GPIO_LED (R49.2 VT7.G)
#SYS_RST: 001_Jetson_Nano (VD2.1 X1.239 X3.1), 002_Buck_Converter (DD5.13), 004_USB (DD9.14)
DP_AUX_N: 001_Jetson_Nano (X1.90), 005_DP (C54.1)
DP_AUX_P: 001_Jetson_Nano (X1.92), 005_DP (C49.1)
DP_HPD: 001_Jetson_Nano (X1.88), 005_DP (DD10.4)
DP_TX0_N: 001_Jetson_Nano (X1.39), 005_DP (C50.1)
DP_TX0_P: 001_Jetson_Nano (X1.41), 005_DP (C45.1)
DP_TX1_N: 001_Jetson_Nano (X1.45), 005_DP (C51.1)
DP_TX1_P: 001_Jetson_Nano (X1.47), 005_DP (C46.1)
DP_TX2_N: 001_Jetson_Nano (X1.51), 005_DP (C52.1)
DP_TX2_P: 001_Jetson_Nano (X1.53), 005_DP (C47.1)
DP_TX3_N: 001_Jetson_Nano (X1.57), 005_DP (C53.1)
DP_TX3_P: 001_Jetson_Nano (X1.59), 005_DP (C48.1)
FAN_PWM: 001_Jetson_Nano (X1.230), 008_Fan_GPIO_LED (DD15.3 R45.2)
FAN_TACH: 001_Jetson_Nano (X1.218), 008_Fan_GPIO_LED (R46.1 VT6.S)
GBE_D0_N: 001_Jetson_Nano (X1.184), 007_Ethernet (X12.3)
GBE_D0_P: 001_Jetson_Nano (X1.186), 007_Ethernet (X12.2)
GBE_D1_N: 001_Jetson_Nano (X1.190), 007_Ethernet (X12.7)
GBE_D1_P: 001_Jetson_Nano (X1.192), 007_Ethernet (X12.4)
GBE_D2_N: 001_Jetson_Nano (X1.196), 007_Ethernet (X12.6)
GBE_D2_P: 001_Jetson_Nano (X1.198), 007_Ethernet (X12.5)
GBE_D3_N: 001_Jetson_Nano (X1.202), 007_Ethernet (X12.9)
GBE_D3_P: 001_Jetson_Nano (X1.204), 007_Ethernet (X12.8)
GBE_LED_ACT: 001_Jetson_Nano (X1.194), 007_Ethernet (R39.1)
GBE_LED_LINK: 001_Jetson_Nano (X1.188), 007_Ethernet (R38.1)
GPIO_PWM_USER: 001_Jetson_Nano (X1.228), 008_Fan_GPIO_LED (DD14.2)
GPIO_USER1: 001_Jetson_Nano (X1.126), 008_Fan_GPIO_LED (DD14.3)
GPIO_USER2: 001_Jetson_Nano (X1.127), 008_Fan_GPIO_LED (DD14.4)
GPIO_USER3: 001_Jetson_Nano (X1.128), 008_Fan_GPIO_LED (DD14.5)
HDMI_CEC: 001_Jetson_Nano (X1.94), 006_HDMI (R28.2 VT2.S)
HDMI_CLK_N: 001_Jetson_Nano (X1.81), 006_HDMI (C64.1)
HDMI_CLK_P: 001_Jetson_Nano (X1.83), 006_HDMI (C60.1)
HDMI_HPD: 001_Jetson_Nano (X1.96), 006_HDMI (R29.1 VT1.D)
HDMI_SCL: 001_Jetson_Nano (X1.100), 006_HDMI (R26.1 VT3.S)
HDMI_SDA: 001_Jetson_Nano (X1.98), 006_HDMI (R27.1 VT4.S)
HDMI_TX0_N: 001_Jetson_Nano (X1.75), 006_HDMI (C65.1)
HDMI_TX0_P: 001_Jetson_Nano (X1.77), 006_HDMI (C61.1)
HDMI_TX1_N: 001_Jetson_Nano (X1.69), 006_HDMI (C66.1)
HDMI_TX1_P: 001_Jetson_Nano (X1.71), 006_HDMI (C62.1)
HDMI_TX2_N: 001_Jetson_Nano (X1.63), 006_HDMI (C67.1)
HDMI_TX2_P: 001_Jetson_Nano (X1.65), 006_HDMI (C63.1)
UART1_RX: 001_Jetson_Nano (X1.205), 003_Serial_Port (DD7.3)
UART1_TX: 001_Jetson_Nano (X1.203), 003_Serial_Port (DD7.2)
UART2_RX: 001_Jetson_Nano (X1.238), 003_Serial_Port (DD7.5)
UART2_TX: 001_Jetson_Nano (X1.236), 003_Serial_Port (DD7.4)
USB0_D_N: 001_Jetson_Nano (X1.109), 004_USB (VD7.1)
USB0_D_P: 001_Jetson_Nano (X1.111), 004_USB (VD7.3)
USB1_D_N: 001_Jetson_Nano (X1.115), 004_USB (VD8.1)
USB1_D_P: 001_Jetson_Nano (X1.117), 004_USB (VD8.3)
USB2_D_N: 001_Jetson_Nano (X1.121), 004_USB (VD9.4 VD9.11 X9.2)
USB2_D_P: 001_Jetson_Nano (X1.123), 004_USB (VD9.3 VD9.12 X9.3)
USBSS_RX_N: 001_Jetson_Nano (X1.161), 004_USB (VD9.1 VD9.14 X9.5)
USBSS_RX_P: 001_Jetson_Nano (X1.163), 004_USB (VD9.2 VD9.13 X9.6)
USBSS_TX_N: 001_Jetson_Nano (X1.166), 004_USB (C38.1)
USBSS_TX_P: 001_Jetson_Nano (X1.168), 004_USB (C39.1)